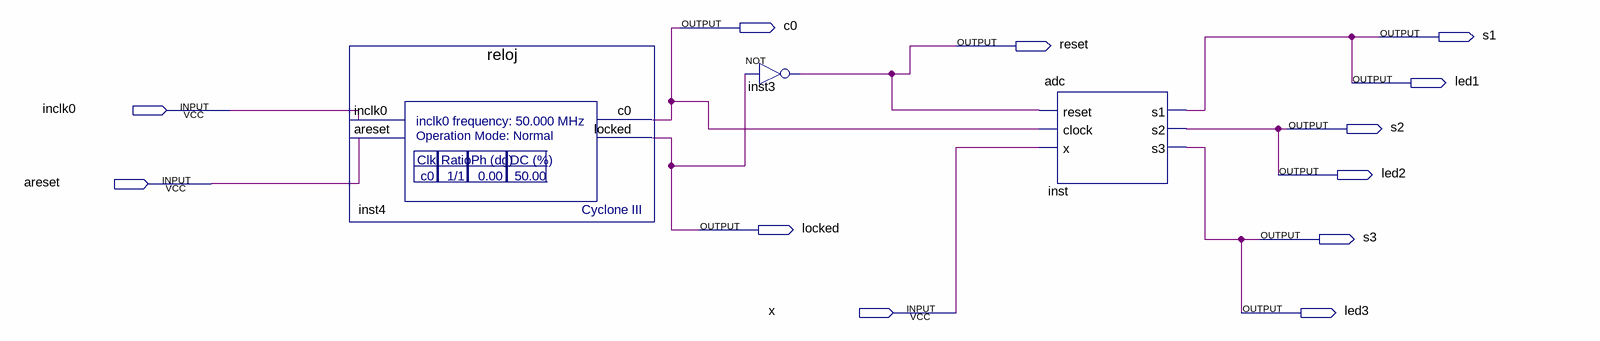
[diagram p0: schematic sheet]
// Quartus schematic Block1.bdf as structural Verilog: 3 symbols, 12 pins
module Block1 (
  input  inclk0,
  input  areset,
  input  x,
  output c0,
  output s1,
  output reset,
  output led1,
  output s2,
  output led2,
  output locked,
  output s3,
  output led3
);

  reloj inst4 (.inclk0(inclk0), .areset(areset), .c0(c0), .locked(locked));
  not inst3 (reset, locked);
  adc inst (.reset(reset), .clock(c0), .x(x), .s1(led1), .s2(led2), .s3(led3));

  assign s1 = led1;
  assign s2 = led2;
  assign s3 = led3;
endmodule
